# Altium schematic sheet HIM.SchDoc: IHM
size A4; Date: 04/19/2026; CheckedBy: Lanfroid-Nazac Guillaume; Author: DÉRONNE Mathis; DrawnBy: DÉRONNE Mathis; Revision: v1.1; SheetNumber: 7; SheetTotal: 7; ModifiedBy: Lanfroid-Nazac Guillaume
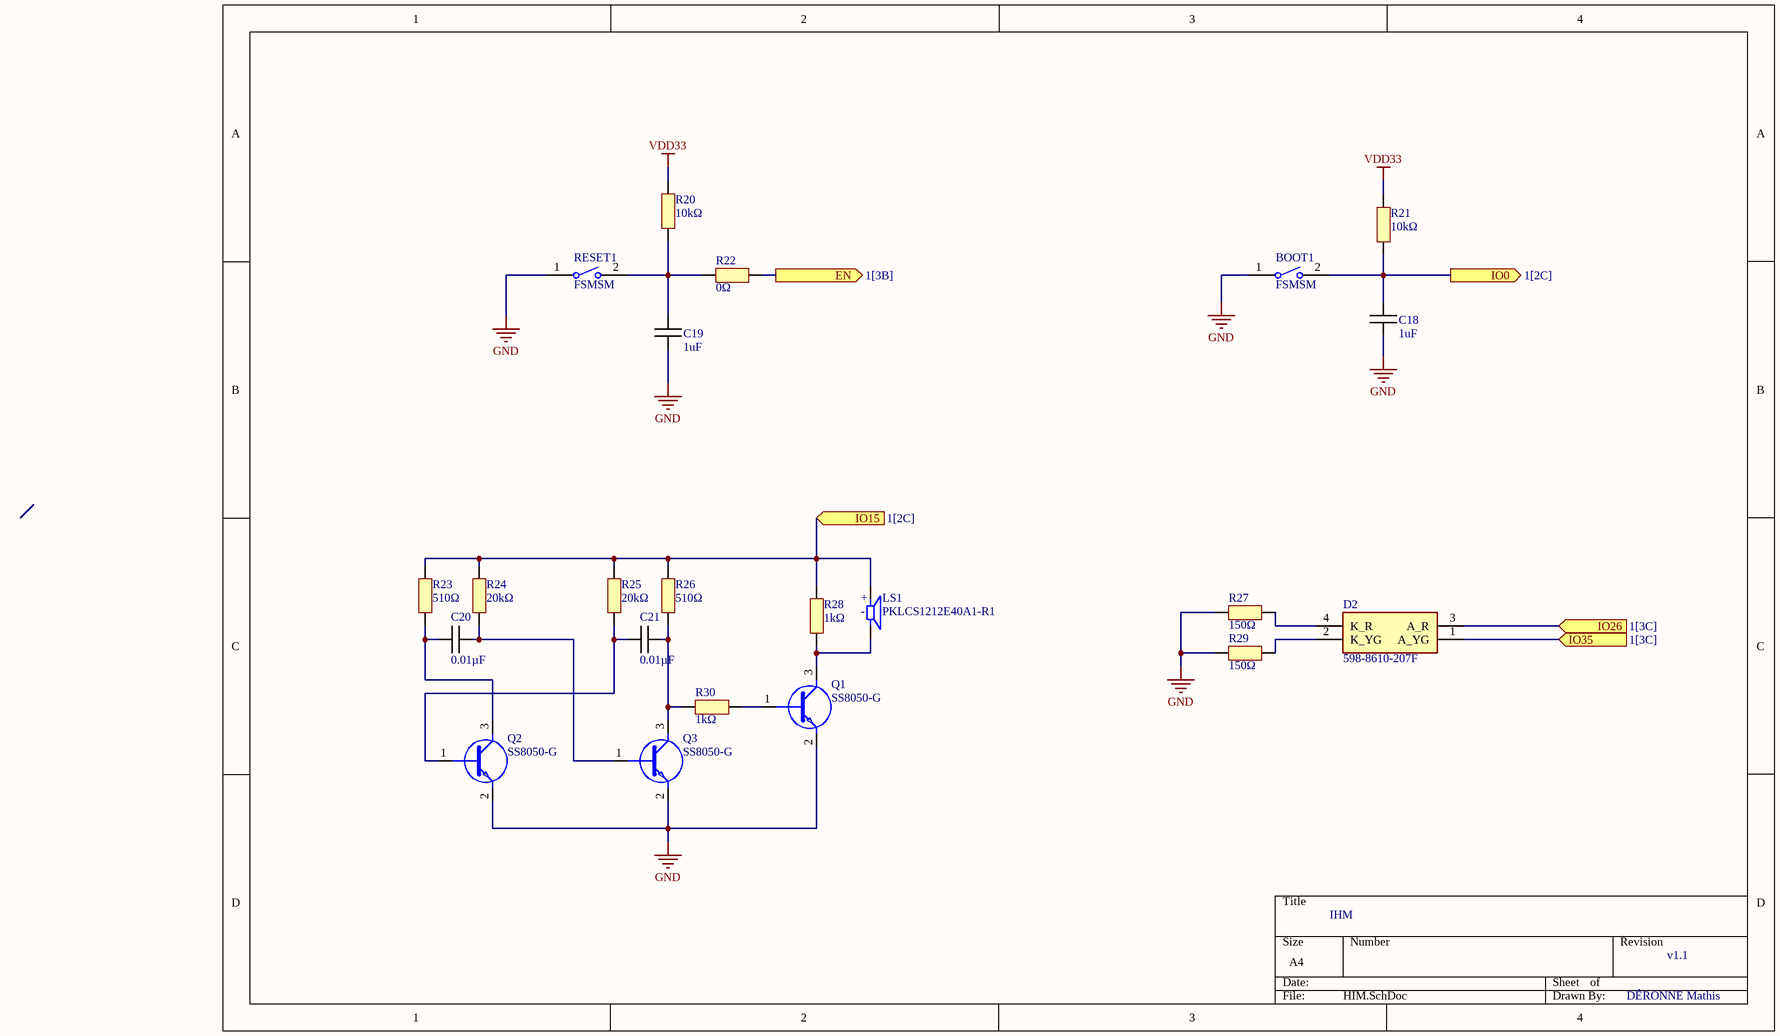
[diagram p0: HIM.SchDoc]

## Parts
BOOT1  FSMSM  [TECO-FSMSM-2_V]
C18  1uF  [CAPC1005X06N]
C19  1uF  [CAPC1005X06N]
C20  0.01µF  [CAPC1005X06N]
C21  0.01µF  [CAPC1005X06N]
D2  598-8610-207F  [5988610207F]
LS1  PKLCS1212E40A1-R1  [SPKR_PKLCS1212E40A1-R1]
Q1  SS8050-G  [SS8050-G]
Q2  SS8050-G  [SS8050-G]
Q3  SS8050-G  [SS8050-G]
R20  10kΩ  [RESC1005X06N]
R21  10kΩ  [RESC1005X06N]
R22  0Ω  [RESC1005X06N]
R23  510Ω  [RESC1005X06N]
R24  20kΩ  [RESC1005X06N]
R25  20kΩ  [RESC1005X06N]
R26  510Ω  [RESC1005X06N]
R27  150Ω  [RESC1005X06N]
R28  1kΩ  [RESC1005X06N]
R29  150Ω  [RESC1005X06N]
R30  1kΩ  [RESC1005X06N]
RESET1  FSMSM  [TECO-FSMSM-2_V]

## Ports
EN (out, see 1[3B]), IO0 (out, see 1[2C]), IO15 (in, see 1[2C]), IO26 (in, see 1[3C]), IO35 (in, see 1[3C])

## Nets
GND: BOOT1.1 C18.2 C19.2 Q1.2(E) Q2.2(E) Q3.2(E) R27.1 R29.1 RESET1.1
VDD33: R20.2 R21.2
EN: R22.2 ; port EN
IO0: BOOT1.2 C18.1 R21.1 ; port IO0
IO15: LS1.P R23.2 R24.2 R25.2 R26.2 R28.2 ; port IO15
IO26: D2.3(A_R) ; port IO26
IO35: D2.1(A_YG) ; port IO35
NetC19_1: C19.1 R20.1 R22.1 RESET1.2
NetC20_1: C20.1 Q2.3(C) R23.1
NetC20_2: C20.2 Q3.1(B) R24.1
NetC21_1: C21.1 Q2.1(B) R25.1
NetC21_2: C21.2 Q3.3(C) R26.1 R30.1
NetD2_2: D2.2(K_YG) R29.2
NetD2_4: D2.4(K_R) R27.2
NetLS1_N: LS1.N Q1.3(C) R28.1
NetQ1_1: Q1.1(B) R30.2

## Notes on the sheet
- (in symbol PKLCS1212E40A1-R1) +; -

## Library data of the parts
BOOT1 RESET1 = CMP-2000-07511-1: FSMSM Push Button Switch, 50 mA, -35 to 85 degC, 2-Pin SMD, RoHS, Bulk; Manufacturer: TE Connectivity; Actuator Length: 1.07mm; Electrical Life: 20000Cycles; Actuator Material: Polyamide; Current Rating: 50mA; Illumination Type: Illuminated; Voltage Rating (DC): 24V; Contact Resistance: 100mOhm; Case\/Package: SMD/SMT; Operating Force: 180gf; Switch Travel: 0.25mm; Max Voltage Rating (DC): 12V; Throw Configuration: SPST; Packaging: LoosePiece; Max Operating Temperature: 85degC; ELV: Compliant; Package Description: 2-Pin Surface Mount Device, Body 6 x 3.5 mm, Pitch 9.19 mm; RoHSCompliant: true; Manufacturer URL: http://www.te.com/; Contact Plating: Silver; Contact Material: Brass; Mounting Technology: SurfaceMount; Contact Current Rating: 50mA; Datasheet Version: Rev. C2, 08/2014; Datasheet URL: http://www.te.com/commerce/DocumentDelivery/DDEController?Action=showdoc&DocId=Customer+Drawing%7F1437566-3%7FC2%7Fpdf%7FEnglish%7FENG_CD_1437566-3_C2_1437566_3_1_c.dwg.pdf%7F1437566-3; Mechanical Life: 20000Cycles; Package Reference: FSMSM; REACH SVHC: Unknown; Orientation: Straight; Min Operating Temperature: -35degC; Lead Free: LeadFree; Termination: GullWing; Package Quantity: 1000; Mount: SurfaceMount
C18-C21 = Capacitor
D2 = 598-8610-207F: Standard LEDs - SMD Red/Green WC 80/50mcd 645/570nm; Manufacturer_Name: Dialight; Geometry.Height: 0.8mm; Manufacturer_Part_Number: 598-8610-207F; Mouser Part Number: 645-598-8610-207F; Mouser Price/Stock: https://www.mouser.co.uk/ProductDetail/Dialight/598-8610-207F?qs=7JStj%2FjQ2SFuCjosqwklHQ%3D%3D; Arrow Part Number: 598-8610-207F; Arrow Price/Stock: https://www.arrow.com/en/products/598-8610-207f/dialight?region=nac; Datasheet Link: https://media.digikey.com/pdf/Data%20Sheets/Dialight%20PDFs/598%20Series%201210%20Pkg%20Bi-Color.pdf
LS1 = PKLCS1212E40A1-R1: Buzzers Transducer, Externally Driven Piezo 1.5V 2kHz 70dB @ 1.5V, 10cm Surface Mount Solder Pads; MF: Murata Electronics; Value: *; MP: PKLCS1212E40A1-R1; Package: None; Availability: Unavailable; Price: None
Q1-Q3 = SS8050-G: Bipolar Transistors - BJT NPN TRANSISTOR 1.5A 40V
R20-R30 = Resistor